# Altium schematic sheet S&H.SchDoc
size A4
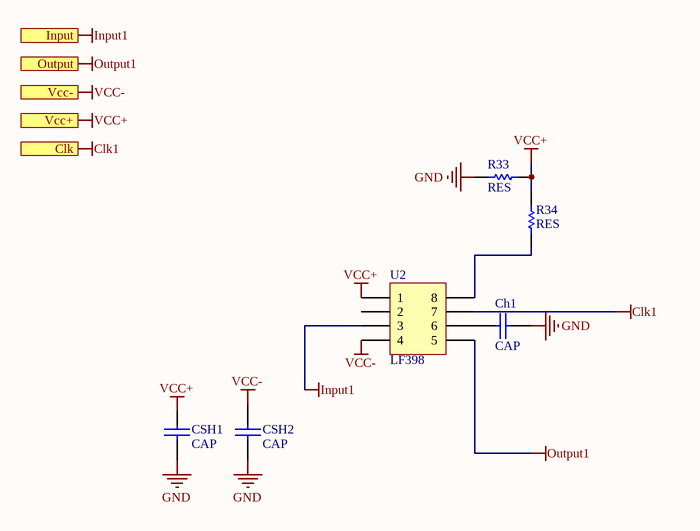
[diagram p0: S&H.SchDoc]

## Parts
Ch1  CAP  [CAP200]
CSH1  CAP  [CAP200]
CSH2  CAP  [CAP200]
R33  RES  [RES400]
R34  RES  [RES400]
U2  LF398  [DIP8]

## Ports
Clk, Input, Output, Vcc+, Vcc-

## Nets
Clk1: U2.7 ; port Clk
GND: Ch1.2 CSH1.2 CSH2.2 R33.1
Input1: U2.3 ; port Input
Output1: U2.5 ; port Output
VCC+: R33.2 R34.2 U2.1 ; port Vcc+
VCC-: CSH2.1 U2.4 ; port Vcc-
NetCh1_1: Ch1.1 U2.6
NetR34_1: R34.1 U2.8

Not connected (* = marked no-connect by the designer): CSH1 1; U2 2

## Notes on the sheet
- Labels drawn without touching a wire or pin: VCC+

## Library data of the parts
U2 = IC_DIP8